# Altium schematic sheet Versterkers.SchDoc
size A4; SheetNumber: 2; SheetTotal: 5
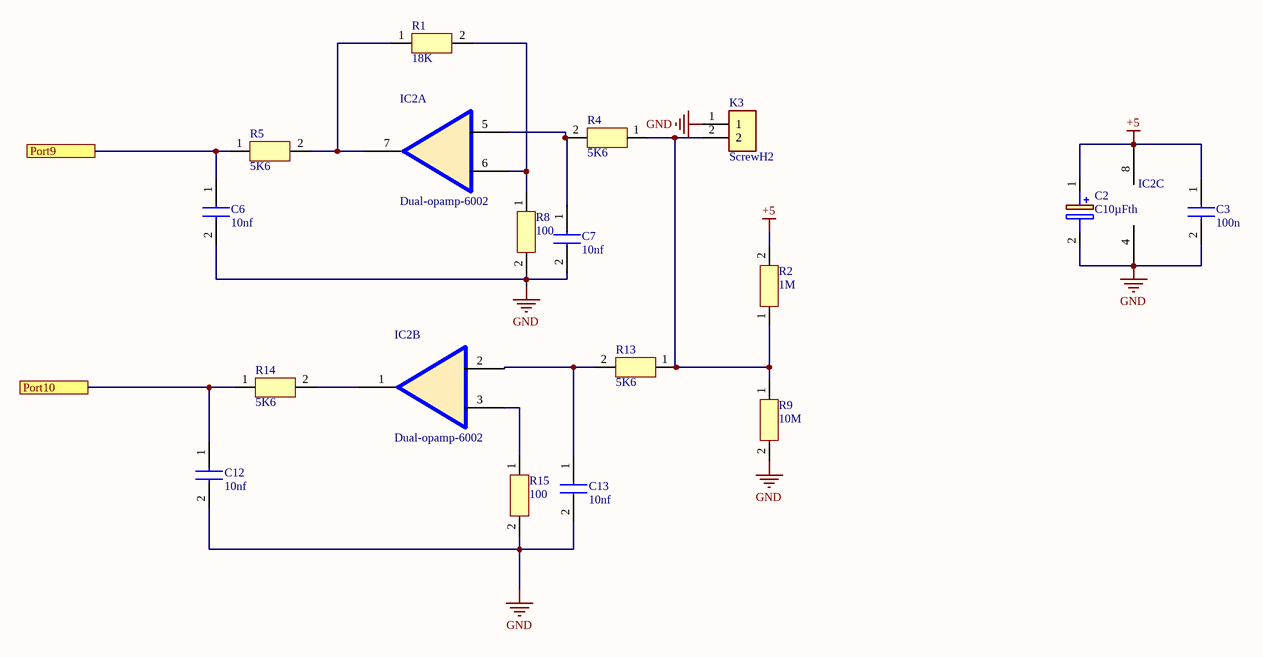
[diagram p0: Versterkers.SchDoc]

## Parts
C2  C10µFth  [C10µFth]
C3  100n  [0805]
C6  10nf  [0805]
C7  10nf  [0805]
C12  10nf  [0805]
C13  10nf  [0805]
IC2  Dual-opamp-6002  [Dual-opamp-6002]  (parts A,B,C of 3)
K3  ScrewH2  [ScewH2]
R1  18K  [0805]
R2  1M  [0805]
R4  5K6  [0805]
R5  5K6  [0805]
R8  100  [0805]
R9  10M  [0805]
R13  5K6  [0805]
R14  5K6  [0805]
R15  100  [0805]

## Ports
Port9, Port10

## Nets
+5: C2.1(+) C3.1 IC2.8 R2.2
GND: C2.2(-) C3.2 C6.2 C7.2 C12.2 C13.2 IC2.4 K3.1 R8.2 R9.2 R15.2
Port9: C6.1 R5.1 ; port Port9
Port10: C12.1 R14.1 ; port Port10
NetC7_1: C7.1 IC2.5(Vin) R4.2
NetC13_1: C13.1 IC2.2(Vin) R13.2
NetIC2_1: IC2.1(Vout) R14.2
NetIC2_3: IC2.3(Vin-) R15.1
NetIC2_6: IC2.6(Vin-) R1.2 R8.1
NetIC2_7: IC2.7(Vout) R1.1 R5.2
NetK3_2: K3.2 R2.1 R4.1 R9.1 R13.1

## Library data of the parts
C2 = C10µFth: Capacitor Polarised; Manufacturer_Name: Panasonic; Manufacturer_Part_Number: ECA-1HM100I; Datasheet Link: https://componentsearchengine.com//ECA-1HM100I.pdf; Height: 12mm; Mouser2 Part Number: 667-ECA-1HM100I; Mouser2 Price/Stock: https://www.mouser.com/Search/Refine.aspx?Keyword=667-ECA-1HM100I
C3 C6 C7 C12 C13 = C0805smd: Capacitor; Manufacturer_Name: Kemet; Manufacturer_Part_Number: C0805C301G5GACTU; Datasheet Link: https://connect.kemet.com:7667/gateway/IntelliData-ComponentDocumentation/1.0/download/specsheet/C0805C301G5GACTU; Height: 0.88mm
IC2 = Dual-opamp-6002: Integrated Circuit; Manufacturer_Name: Microchip; Manufacturer_Part_Number: MCP6002-E/P; Datasheet Link: https://componentsearchengine.com//MCP6002-E_P.pdf; Height: 5.334mm; Mouser2 Part Number: 579-MCP6002-E/P; Mouser2 Price/Stock: https://www.mouser.com/Search/Refine.aspx?Keyword=579-MCP6002-E%2FP
K3 = ScrewH2: Connector; Manufacturer_Name: CUI Inc.; Manufacturer_Part_Number: TB007-508-02BE; Datasheet Link: https://componentsearchengine.com//TB007-508-02BE.pdf; Height: 14mm; Mouser2 Part Number: 490-TB007-508-02BE; Mouser2 Price/Stock: https://www.mouser.com/Search/Refine.aspx?Keyword=490-TB007-508-02BE
R1 R2 R4 R5 R8 R9 R13-R15 = R-0805: Resistor; Manufacturer_Name: Vishay; Manufacturer_Part_Number: TNPU0805500RAZEN00; Height: 0.55mm